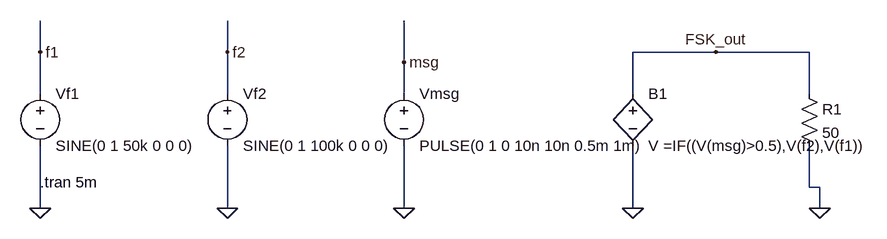
[diagram p0: schematic FSK.asc]
FSK.asc, the LTspice schematic file:
Version 4.1
SHEET 1 1252 680
WIRE -64 48 -64 0
WIRE 224 48 224 0
WIRE 976 48 848 48
WIRE 1120 48 976 48
WIRE 496 64 496 0
WIRE -64 112 -64 48
WIRE 224 112 224 48
WIRE 496 112 496 64
WIRE 848 112 848 48
WIRE 1120 112 1120 48
WIRE 1120 256 1120 192
WIRE 1136 256 1120 256
WIRE -64 288 -64 192
WIRE 224 288 224 192
WIRE 496 288 496 192
WIRE 848 288 848 192
WIRE 1136 288 1136 256
FLAG -64 288 0
FLAG 224 288 0
FLAG 496 288 0
FLAG 848 288 0
FLAG 1136 288 0
FLAG -64 48 f1
FLAG 224 48 f2
FLAG 496 64 msg
FLAG 976 48 FSK_out
SYMBOL voltage -64 96 R0
WINDOW 123 0 0 Left 0
WINDOW 39 0 0 Left 0
SYMATTR InstName Vf1
SYMATTR Value SINE(0 1 50k 0 0 0)
SYMBOL voltage 224 96 R0
WINDOW 123 0 0 Left 0
WINDOW 39 0 0 Left 0
SYMATTR InstName Vf2
SYMATTR Value SINE(0 1 100k 0 0 0)
SYMBOL voltage 496 96 R0
WINDOW 123 0 0 Left 0
WINDOW 39 0 0 Left 0
SYMATTR InstName Vmsg
SYMATTR Value PULSE(0 1 0 10n 10n 0.5m 1m)
SYMBOL bv 848 96 R0
SYMATTR InstName B1
SYMATTR Value V =IF((V(msg)>0.5),V(f2),V(f1))
SYMBOL res 1104 96 R0
SYMATTR InstName R1
SYMATTR Value 50
TEXT -64 248 Left 2 !.tran 5m

The netlist it stands for:
* FSK.asc
Vf1 f1 0 SINE(0 1 50k 0 0 0)
Vf2 f2 0 SINE(0 1 100k 0 0 0)
Vmsg msg 0 PULSE(0 1 0 10n 10n 0.5m 1m)
B1 FSK_out 0 V =IF((V(msg)>0.5),V(f2),V(f1))
R1 FSK_out 0 50
.tran 5m
.backanno
.end